# Altium schematic sheet ssd1963.SchDoc
size C
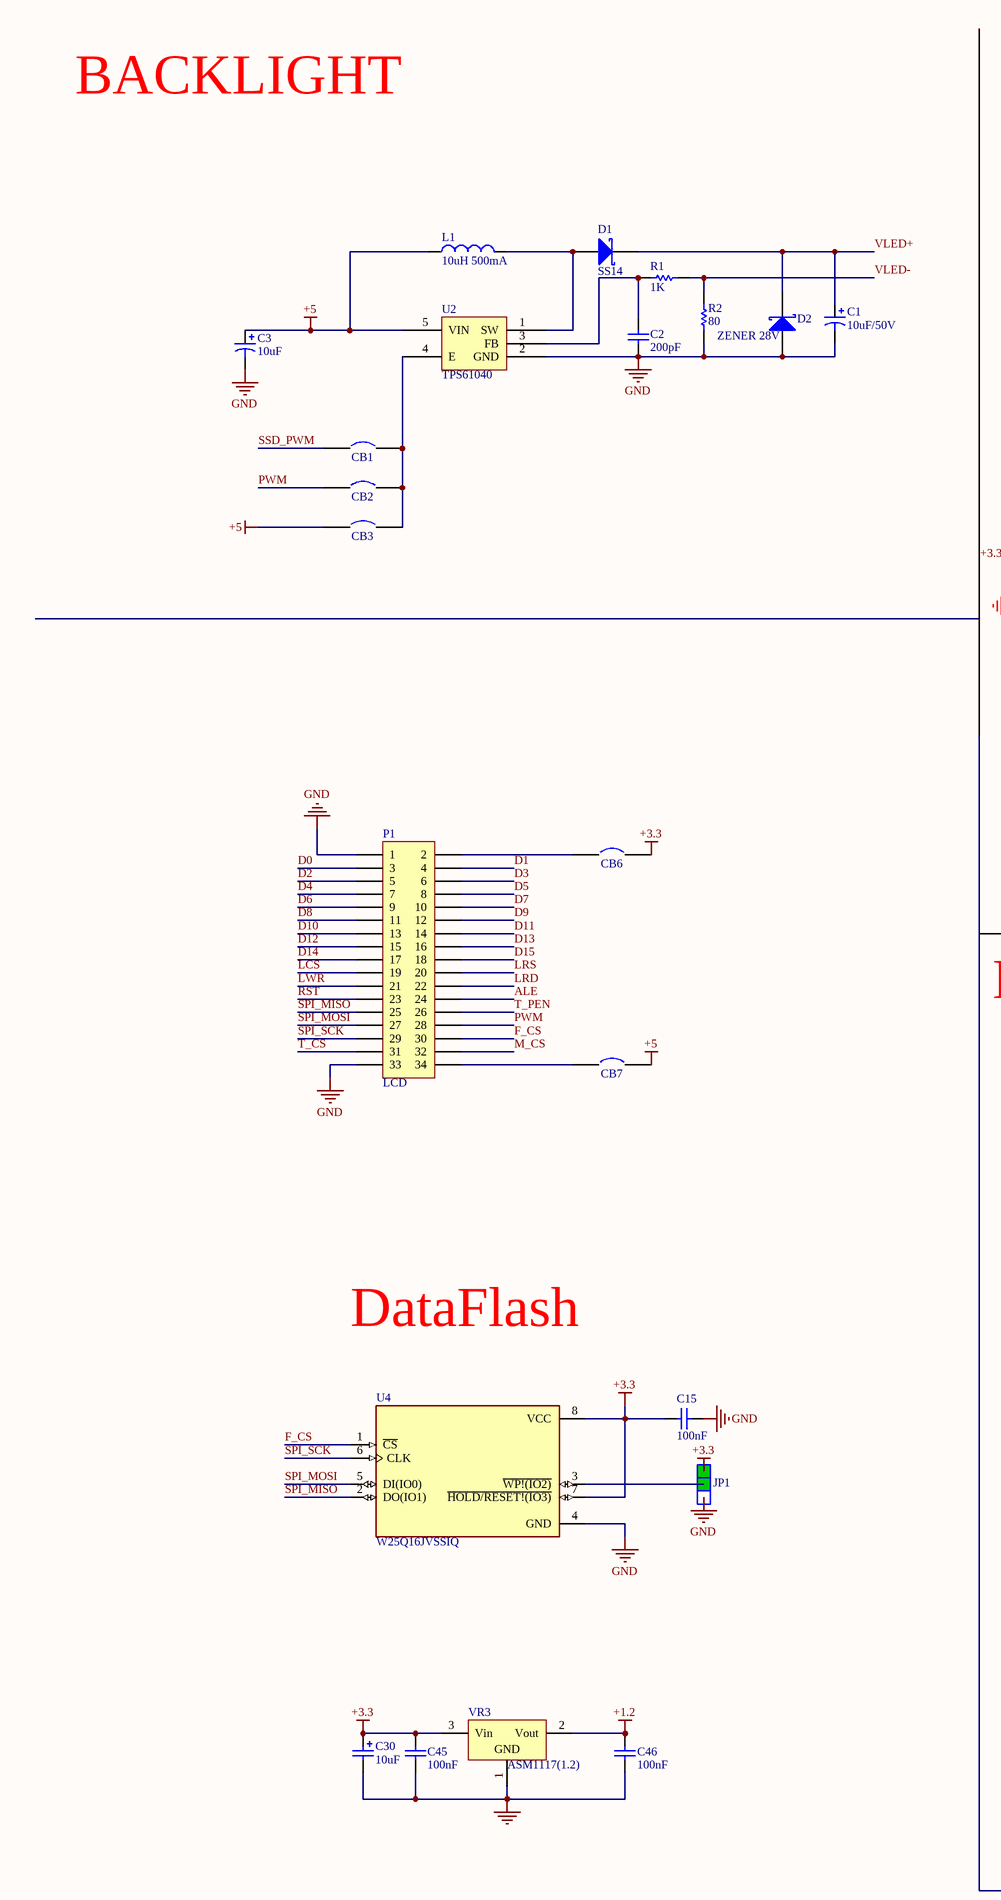
[diagram p0: ssd1963.SchDoc, left]
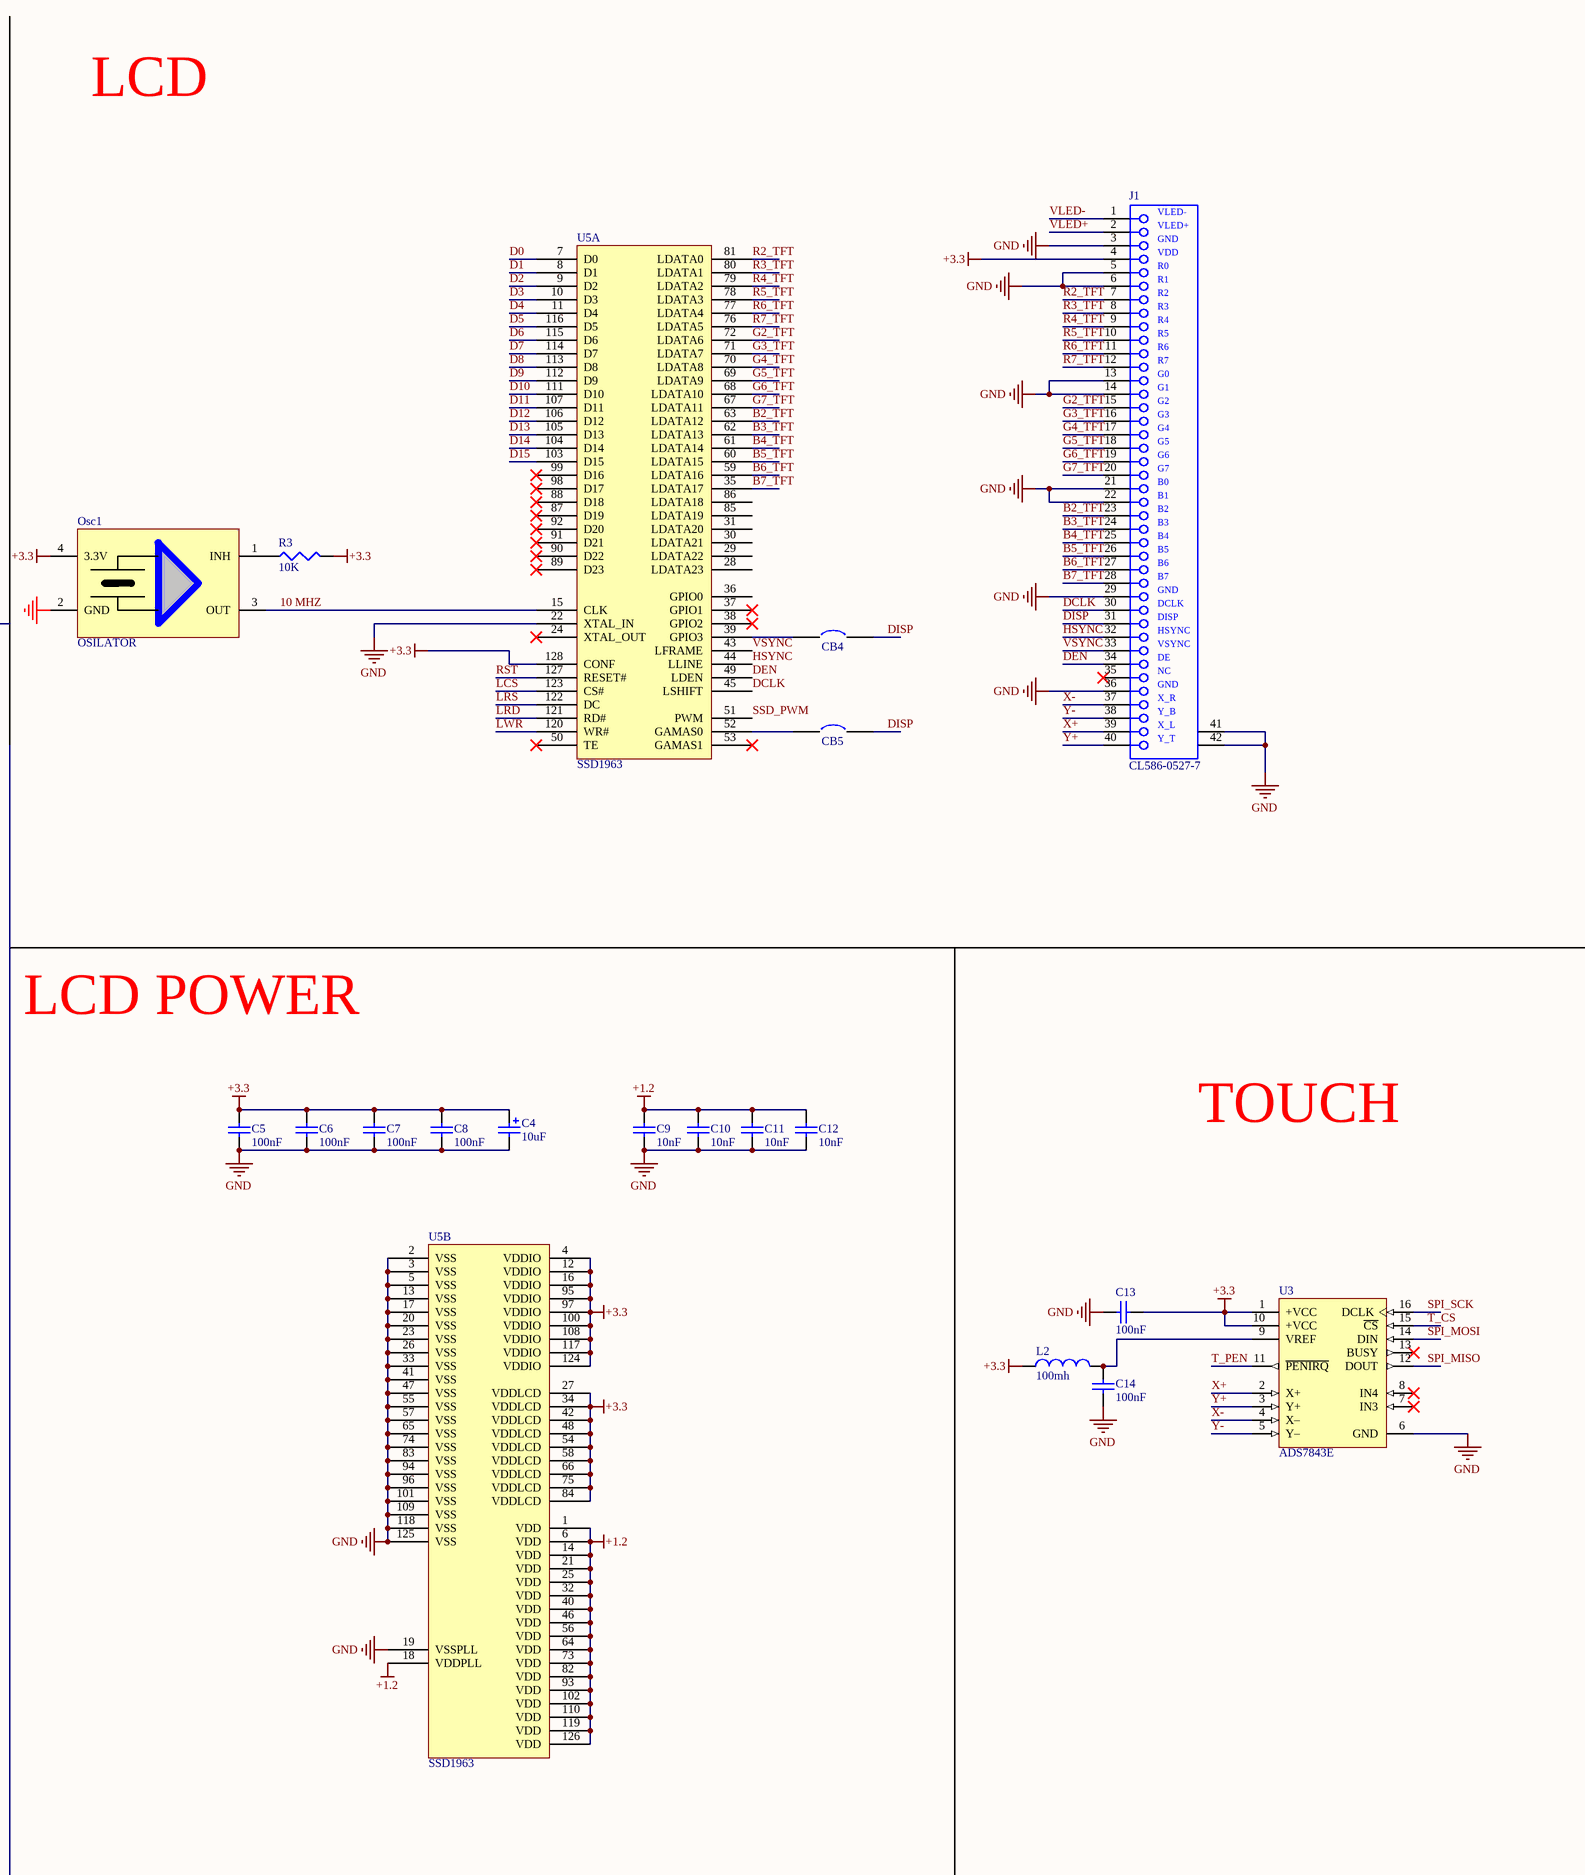
[diagram p1: ssd1963.SchDoc, right]

## Parts
C1  10uF/50V  [Tantalium Size A]
C2  200pF  [0805]
C3  10uF  [Tantalium Size A]
C4  10uF  [Tantalium Size A]
C5  100nF  [0805]
C6  100nF  [0805]
C7  100nF  [0805]
C8  100nF  [0805]
C9  10nF  [0805]
C10  10nF  [0805]
C11  10nF  [0805]
C12  10nF  [0805]
C13  100nF  [0805]
C14  100nF  [0805]
C15  100nF  [0805]
C30  10uF  [Tantalium Size A]
C45  100nF  [0805]
C46  100nF  [0805]
CB1  JUMPER  [0805]  (value not drawn)
CB2  JUMPER  [0805]  (value not drawn)
CB3  JUMPER  [0805]  (value not drawn)
CB4  JUMPER  [0805]  (value not drawn)
CB5  JUMPER  [0805]  (value not drawn)
CB6  JUMPER  [0805]  (value not drawn)
CB7  JUMPER  [0805]  (value not drawn)
D1  SS14  [1N4004SMD]
D2  ZENER 28V  [1N4004SMD]
J1  CL586-0527-7  [FPC_40PIN]
JP1  Jumper  [JT3]  (value not drawn)
L1  10uH 500mA  [INDUCT100UH B]
L2  100mh  [1206]
Osc1  OSILATOR  [XTAL_5X7]
P1  LCD  [HDR2X17]
R1  1K  [0805]
R2  80  [0805]
R3  10K  [0805]
U2  TPS61040  [TPS61040]
U3  ADS7843E  [DBQ016]
U4  W25Q16JVSSIQ  [SOIC127P790X216-8N]
U5  SSD1963  [TSQFP40P1600X1600-128N]  (parts A,B of 2)
VR3  ASM1117(1.2)  [ASM1117]

## Nets
+1.2: C9.1 C10.1 C11.1 C12.1 C46.1 U5.1(VDD) U5.6(VDD) U5.14(VDD) U5.18(VDDPLL) U5.21(VDD) U5.25(VDD) U5.32(VDD) U5.40(VDD) U5.46(VDD) U5.56(VDD) U5.64(VDD) U5.73(VDD) U5.82(VDD) U5.93(VDD) U5.102(VDD) U5.110(VDD) U5.119(VDD) U5.126(VDD) VR3.2(Vout)
+3.3: C4.1 C5.1 C6.1 C7.1 C8.1 C13.2 C15.1 C30.1 C45.1 CB6.2 J1.4 JP1.1 L2.1 Osc1.4(3.3V) R3.2 U3.1(+VCC) U3.10(+VCC) U4.7(~{HOLD/RESET!(IO3)}) U4.8(VCC) U5.4(VDDIO) U5.12(VDDIO) U5.16(VDDIO) U5.27(VDDLCD) U5.34(VDDLCD) U5.42(VDDLCD) U5.48(VDDLCD) U5.54(VDDLCD) U5.58(VDDLCD) U5.66(VDDLCD) U5.75(VDDLCD) U5.84(VDDLCD) U5.95(VDDIO) U5.97(VDDIO) U5.100(VDDIO) U5.108(VDDIO) U5.117(VDDIO) U5.124(VDDIO) U5.128(CONF) VR3.3(Vin)
+5: C3.1 CB3.1 CB7.2 L1.1 U2.5(VIN)
GND: C1.2 C2.1 C3.2 C4.2 C5.2 C6.2 C7.2 C8.2 C9.2 C10.2 C11.2 C12.2 C13.1 C14.1 C15.2 C30.2 C45.2 C46.2 D2.1(A) J1.3 J1.5 J1.6 J1.13 J1.14 J1.21 J1.22 J1.29 J1.36 J1.41(MH1) J1.42(MH2) JP1.3 Osc1.2(GND) P1.1 P1.33 R2.1 U2.2(GND) U3.6(GND) U4.4(GND) U5.2(VSS) U5.3(VSS) U5.5(VSS) U5.13(VSS) U5.17(VSS) U5.19(VSSPLL) U5.20(VSS) U5.22(XTAL_IN) U5.23(VSS) U5.26(VSS) U5.33(VSS) U5.41(VSS) U5.47(VSS) U5.55(VSS) U5.57(VSS) U5.65(VSS) U5.74(VSS) U5.83(VSS) U5.94(VSS) U5.96(VSS) U5.101(VSS) U5.109(VSS) U5.118(VSS) U5.125(VSS) VR3.1(GND)
10 MHZ: Osc1.3(OUT) U5.15(CLK)
ALE: P1.24
B2_TFT: J1.23 U5.63(LDATA12)
B3_TFT: J1.24 U5.62(LDATA13)
B4_TFT: J1.25 U5.61(LDATA14)
B5_TFT: J1.26 U5.60(LDATA15)
B6_TFT: J1.27 U5.59(LDATA16)
B7_TFT: J1.28 U5.35(LDATA17)
D0: P1.3 U5.7(D0)
D1: P1.4 U5.8(D1)
D2: P1.5 U5.9(D2)
D3: P1.6 U5.10(D3)
D4: P1.7 U5.11(D4)
D5: P1.8 U5.116(D5)
D6: P1.9 U5.115(D6)
D7: P1.10 U5.114(D7)
D8: P1.11 U5.113(D8)
D9: P1.12 U5.112(D9)
D10: P1.13 U5.111(D10)
D11: P1.14 U5.107(D11)
D12: P1.15 U5.106(D12)
D13: P1.16 U5.105(D13)
D14: P1.17 U5.104(D14)
D15: P1.18 U5.103(D15)
DCLK: J1.30 U5.45(LSHIFT)
DEN: J1.34 U5.49(LDEN)
DISP: CB4.2 CB5.2 J1.31
F_CS: P1.30 U4.1(~{CS})
G2_TFT: J1.15 U5.72(LDATA6)
G3_TFT: J1.16 U5.71(LDATA7)
G4_TFT: J1.17 U5.70(LDATA8)
G5_TFT: J1.18 U5.69(LDATA9)
G6_TFT: J1.19 U5.68(LDATA10)
G7_TFT: J1.20 U5.67(LDATA11)
HSYNC: J1.32 U5.44(LLINE)
LCS: P1.19 U5.123(CS#)
LRD: P1.22 U5.121(RD#)
LRS: P1.20 U5.122(DC)
LWR: P1.21 U5.120(WR#)
M_CS: P1.32
PWM: CB2.1 P1.28
R2_TFT: J1.7 U5.81(LDATA0)
R3_TFT: J1.8 U5.80(LDATA1)
R4_TFT: J1.9 U5.79(LDATA2)
R5_TFT: J1.10 U5.78(LDATA3)
R6_TFT: J1.11 U5.77(LDATA4)
R7_TFT: J1.12 U5.76(LDATA5)
RST: P1.23 U5.127(RESET#)
SPI_MISO: P1.25 U3.12(DOUT) U4.2(DO(IO1))
SPI_MOSI: P1.27 U3.14(DIN) U4.5(DI(IO0))
SPI_SCK: P1.29 U3.16(DCLK) U4.6(CLK)
SSD_PWM: CB1.1 U5.51(PWM)
T_CS: P1.31 U3.15(~{CS})
T_PEN: P1.26 U3.11(~{PENIRQ})
VLED+: C1.1 D1.2(K) D2.2(K) J1.2
VLED-: J1.1 R1.2 R2.2
VSYNC: J1.33 U5.43(LFRAME)
X+: J1.39 U3.2(X+)
X-: J1.37 U3.4(X–)
Y+: J1.40 U3.3(Y+)
Y-: J1.38 U3.5(Y–)
NetC2_2: C2.2 R1.1 U2.3(FB)
NetC14_2: C14.2 L2.2 U3.9(VREF)
NetCB1_2: CB1.2 CB2.2 CB3.2 U2.4(E)
NetCB4_1: CB4.1 U5.39(GPIO3)
NetCB5_1: CB5.1 U5.52(GAMAS0)
NetCB6_1: CB6.1 P1.2
NetCB7_1: CB7.1 P1.34
NetD1_1: D1.1(A) L1.2 U2.1(SW)
NetJP1_2: JP1.2 U4.3(~{WP!(IO2)})
NetOsc1_1: Osc1.1(INH) R3.1

Not connected (* = marked no-connect by the designer): J1 35*; U3 7(IN3)* 8(IN4)* 13(BUSY)*; U5 24(XTAL_OUT)* 28(LDATA23) 29(LDATA22) 30(LDATA21) 31(LDATA20) 36(GPIO0) 37(GPIO1)* 38(GPIO2)* 50(TE)* 53(GAMAS1)* 85(LDATA19) 86(LDATA18) 87(D19)* 88(D18)* 89(D23)* 90(D22)* 91(D21)* 92(D20)* 98(D17)* 99(D16)*

## Notes on the sheet
- BACKLIGHT
- LCD
- LCD POWER
- TOUCH
- DataFlash
- (in symbol CL586-0527-7) VLED-; VLED+; GND; VDD; R0; R1; R2; R3; R4; R5; R6; R7; G0; G1; G2; G3; G4; G5; G6; G7; B0; B1; B2; B3; B4; B5; B6; B7; DCLK; DISP; HSYNC; VSYNC; DE; NC; X_R; Y_B; X_L; Y_T

## Library data of the parts
C1 C3 = Cap Pol1: Polarized Capacitor (Radial); Value: 100pF; Published: 8-Jun-2000; LatestRevisionDate: 17-Jul-2002; LatestRevisionNote: Re-released for DXP Platform.; PackageReference: RB7.6-15; Publisher: Altium Limited
C2 = Cap Semi: Capacitor (Semiconductor SIM Model); Value: 100pF; Published: 8-Jun-2000; LatestRevisionDate: 29-May-2009; LatestRevisionNote: IPC-7351 Footprint Added.; PackageReference: C1206; Publisher: Altium Limited; PackageDescription: Chip Capacitor
C4 C30 = Cap Pol1: Polarized Capacitor (Radial); Published: 8-Jun-2000; Revision: July-2002: Re-released for DXP Platform.; Publisher: Altium Limited; Value: 10uF
C5-C8 C13-C15 C45 C46 = Cap: Capacitor; Published: 8-Jun-2000; Revision: July-2002: Re-released for DXP Platform.; Publisher: Altium Limited; Value: 100nF
C9-C12 = Cap: Capacitor; Value: 100nF; Published: 8-Jun-2000; Revision: July-2002: Re-released for DXP Platform.; Publisher: Altium Limited
CB1-CB7 = Circuit Breaker: Published: 24-Mar-1999; LatestRevisionDate: 17-Jul-2002; LatestRevisionNote: Re-released for DXP Platform.; PackageReference: SPST-2; Publisher: Altium Limited
D1 D2 = D Schottky: Schottky Diode; Published: 8-Jun-2000; LatestRevisionDate: 17-Jul-2002; LatestRevisionNote: Re-released for DXP Platform.; PackageReference: SMB; Publisher: Altium Limited; Code_JEDEC: DO-214-AA
J1 = CL586-0527-7: FH12 Series, "Flip-Lock" SMT/ZIF FFC/FPC Connector - 0.5mm Spaced Bottom Contact; Positions: 40; ContactMaterial: Phosphor Bronze; Current: 0.4A; PCB_Layout: Complies with manufacturer's recommendation.; Published: 17-Jul-2002; DatasheetVersion: 13-Nov-2000; PackageVersion: 13-Nov-2000; PackageReference: FH12-40S-0.5SH; Publisher: Altium Limited; PadDimensions: Follow nominal values, Suitable for Wave Soldering, Adjust for Re-flow.; ComponentLink1Description: Manufacturer Link; ComponentLink1URL: http://www.hiroseusa.com/; ComponentLink2Description: Datasheet; ComponentLink2URL: http://www.hirose.co.jp/cataloge_hp/e58605370.pdf
JP1 = Jumper Selector
L1 L2 = Inductor: Code_IEC: 1005; Value: 10mH; Published: 8-Jun-2000; LatestRevisionDate: 29-May-2009; LatestRevisionNote: IPC-7351 Footprint Added.; PackageReference: 0402-A; Publisher: Altium Limited; PackageDescription: Chip Inductor; Code_JEITA: 0402
P1 = Header 17X2: Header, 17-Pin, Dual row; LatestRevisionDate: 17-Jul-2002; LatestRevisionNote: Re-released for DXP Platform.; Publisher: Altium Limited
R1 R2 = Res1: Resistor; Value: 10K; Published: 8-Jun-2000; LatestRevisionDate: 17-Jul-2002; LatestRevisionNote: Re-released for DXP Platform.; PackageReference: AXIAL-0.3; Publisher: Altium Limited
R3 = Res3: Resistor; Value: 1K; Published: 8-Jun-2000; LatestRevisionDate: 04-Mar-2005; LatestRevisionNote: PCB Footprint replaced.; PackageReference: J1-0603; Publisher: Altium Limited
U2 = TPS61040: Backlight Regulagtor
U3 = ADS7843E: 4-Wire Touch Screen Controller, 16-Pin SSOP, Pb-Free; Published: 6-Oct-2005; DatasheetVersion: May-2002; PackageVersion: Feb-2005; PackageReference: DBQ016; Publisher: Altium Limited; PackageDescription: SSOP; 16 Leads; Body Width 3.9 mm; Pitch 0.635 mm; Code_JEDEC: MO-137-AB; ComponentLink1Description: Manufacturer Link; ComponentLink1URL: http://focus.ti.com/docs/prod/folders/print/ads7843.html; ComponentLink2Description: Datasheet; ComponentLink2URL: http://focus.ti.com/lit/ds/symlink/ads7843.pdf
U4 = W25Q16JVSSIQ: FLASH - NOR Memory IC 16Mb _2M x 8_ SPI - Quad I/O 133MHz 8-SOIC; MF: Winbond Electronics; Price: None; Package: SOIC-8 Winbond; MP: W25Q16JVSSIQ; Value: *; Availability: Unavailable; SnapEDA_Link: https://www.snapeda.com/parts/W25Q16JVSSIQ/Winbond%20Electronics/view-part/618098/?ref=snap
VR3 = Volt Reg_1: Voltage Regulator; Published: 24-Mar-1999; LatestRevisionDate: 29-May-2009; LatestRevisionNote: IPC-7351 Footprint Added.; PackageReference: D2PAK; Publisher: Altium Limited; PackageDescription: 3-Pin Transistor Outline Package 2.54 mm Pitch, 15.1 mm Lead Span